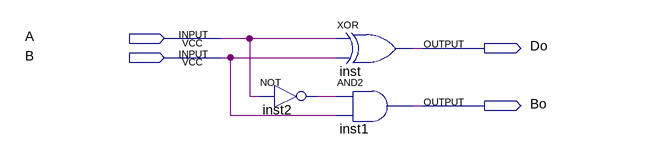
[diagram p0: schematic sheet]
// Quartus schematic Half_subtractor.bdf as structural Verilog: 3 symbols, 4 pins
module Half_subtractor (
  input  A,
  input  B,
  output Do,
  output Bo
);

  wire inst2_out;

  not inst2 (inst2_out, A);
  xor inst (Do, A, B);
  and inst1 (Bo, inst2_out, B);
endmodule
